# Altium schematic sheet 松菸_幻影光靈_屍禁.SchDoc
size A3
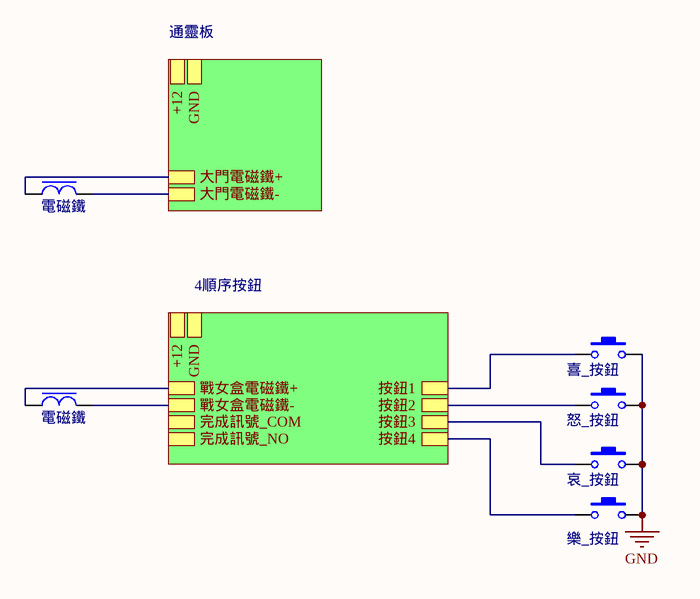
[diagram p0: 松菸_幻影光靈_屍禁.SchDoc]

## Parts
I7  電磁鐵  [Inductor-0420]
I9  電磁鐵  [Inductor-0420]
S24  喜_按鈕  [Switch SMD-3.6*6*2.5]
S25  怒_按鈕  [Switch SMD-3.6*6*2.5]
S26  哀_按鈕  [Switch SMD-3.6*6*2.5]
S27  樂_按鈕  [Switch SMD-3.6*6*2.5]

## Sub-sheets
4順序按鈕 = 松菸_幻影光靈_屍禁_4順序按鈕.SchDoc: 按鈕1, 按鈕2, 按鈕3, 按鈕4, 戰女盒電磁鐵+, 完成訊號_COM, 完成訊號_NO, GND, +12, 戰女盒電磁鐵-
通靈板 = 松菸_幻影光靈_屍禁_通靈板.SchDoc: +12, GND, 大門電磁鐵+, 大門電磁鐵-

## Nets
GND: S24.2 S25.2 S26.2 S27.2
NetI7_1: I7.1 ; sheet 通靈板/大門電磁鐵-
NetI7_2: I7.2 ; sheet 通靈板/大門電磁鐵+
NetI9_1: I9.1 ; sheet 4順序按鈕/戰女盒電磁鐵-
NetI9_2: I9.2 ; sheet 4順序按鈕/戰女盒電磁鐵+
NetS24_1: S24.1 ; sheet 4順序按鈕/按鈕1
NetS25_1: S25.1 ; sheet 4順序按鈕/按鈕2
NetS26_1: S26.1 ; sheet 4順序按鈕/按鈕3
NetS27_1: S27.1 ; sheet 4順序按鈕/按鈕4

## Library data of the parts
I7 I9 = Inductor: 一體成型電感
S24-S27 = Switch: 開關_按鍵